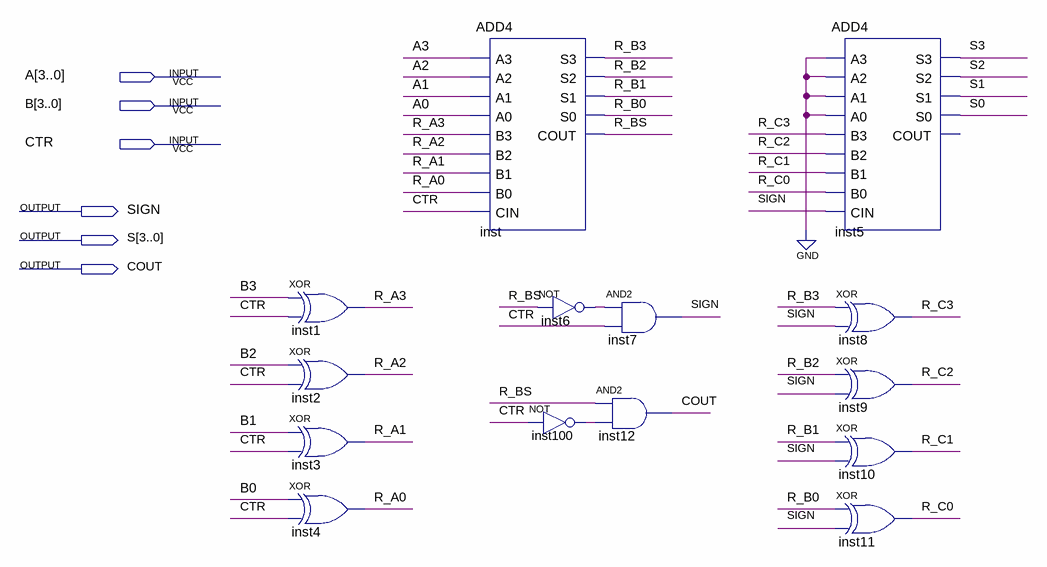
[diagram p0: schematic sheet]
// Quartus schematic ADD_SUB_4.bdf as structural Verilog: 14 symbols, 6 pins
module ADD_SUB_4 (
  input  [3:0] A,
  input  [3:0] B,
  input  CTR,
  output SIGN,
  output [3:0] S,
  output COUT
);

  wire inst6_out, inst100_out, R_A0, R_A1, R_A2, R_A3, R_B0, R_B1, R_B2, R_B3, R_BS, R_C0, R_C1, R_C2, R_C3;

  xor inst1 (R_A3, B[3], CTR);
  xor inst2 (R_A2, B[2], CTR);
  xor inst3 (R_A1, B[1], CTR);
  xor inst4 (R_A0, B[0], CTR);
  ADD4 inst (
    .A3(A[3]), .A2(A[2]), .A1(A[1]), .A0(A[0]), .B3(R_A3), .B2(R_A2), .B1(R_A1), .B0(R_A0), .CIN(CTR),
    .S3(R_B3), .S2(R_B2), .S1(R_B1), .S0(R_B0), .COUT(R_BS));
  not inst6 (inst6_out, R_BS);
  and inst12 (COUT, R_BS, inst100_out);
  not inst100 (inst100_out, CTR);
  and inst7 (SIGN, inst6_out, CTR);
  ADD4 inst5 (
    .A3(1'b0), .A2(1'b0), .A1(1'b0), .A0(1'b0), .B3(R_C3), .B2(R_C2), .B1(R_C1), .B0(R_C0), .CIN(SIGN),
    .S3(S[3]), .S2(S[2]), .S1(S[1]), .S0(S[0]));  // open: COUT
  xor inst8 (R_C3, R_B3, SIGN);
  xor inst9 (R_C2, R_B2, SIGN);
  xor inst10 (R_C1, R_B1, SIGN);
  xor inst11 (R_C0, R_B0, SIGN);
endmodule
